# EAGLE design flashlightswitchv02 (EAGLE 9.0.0)
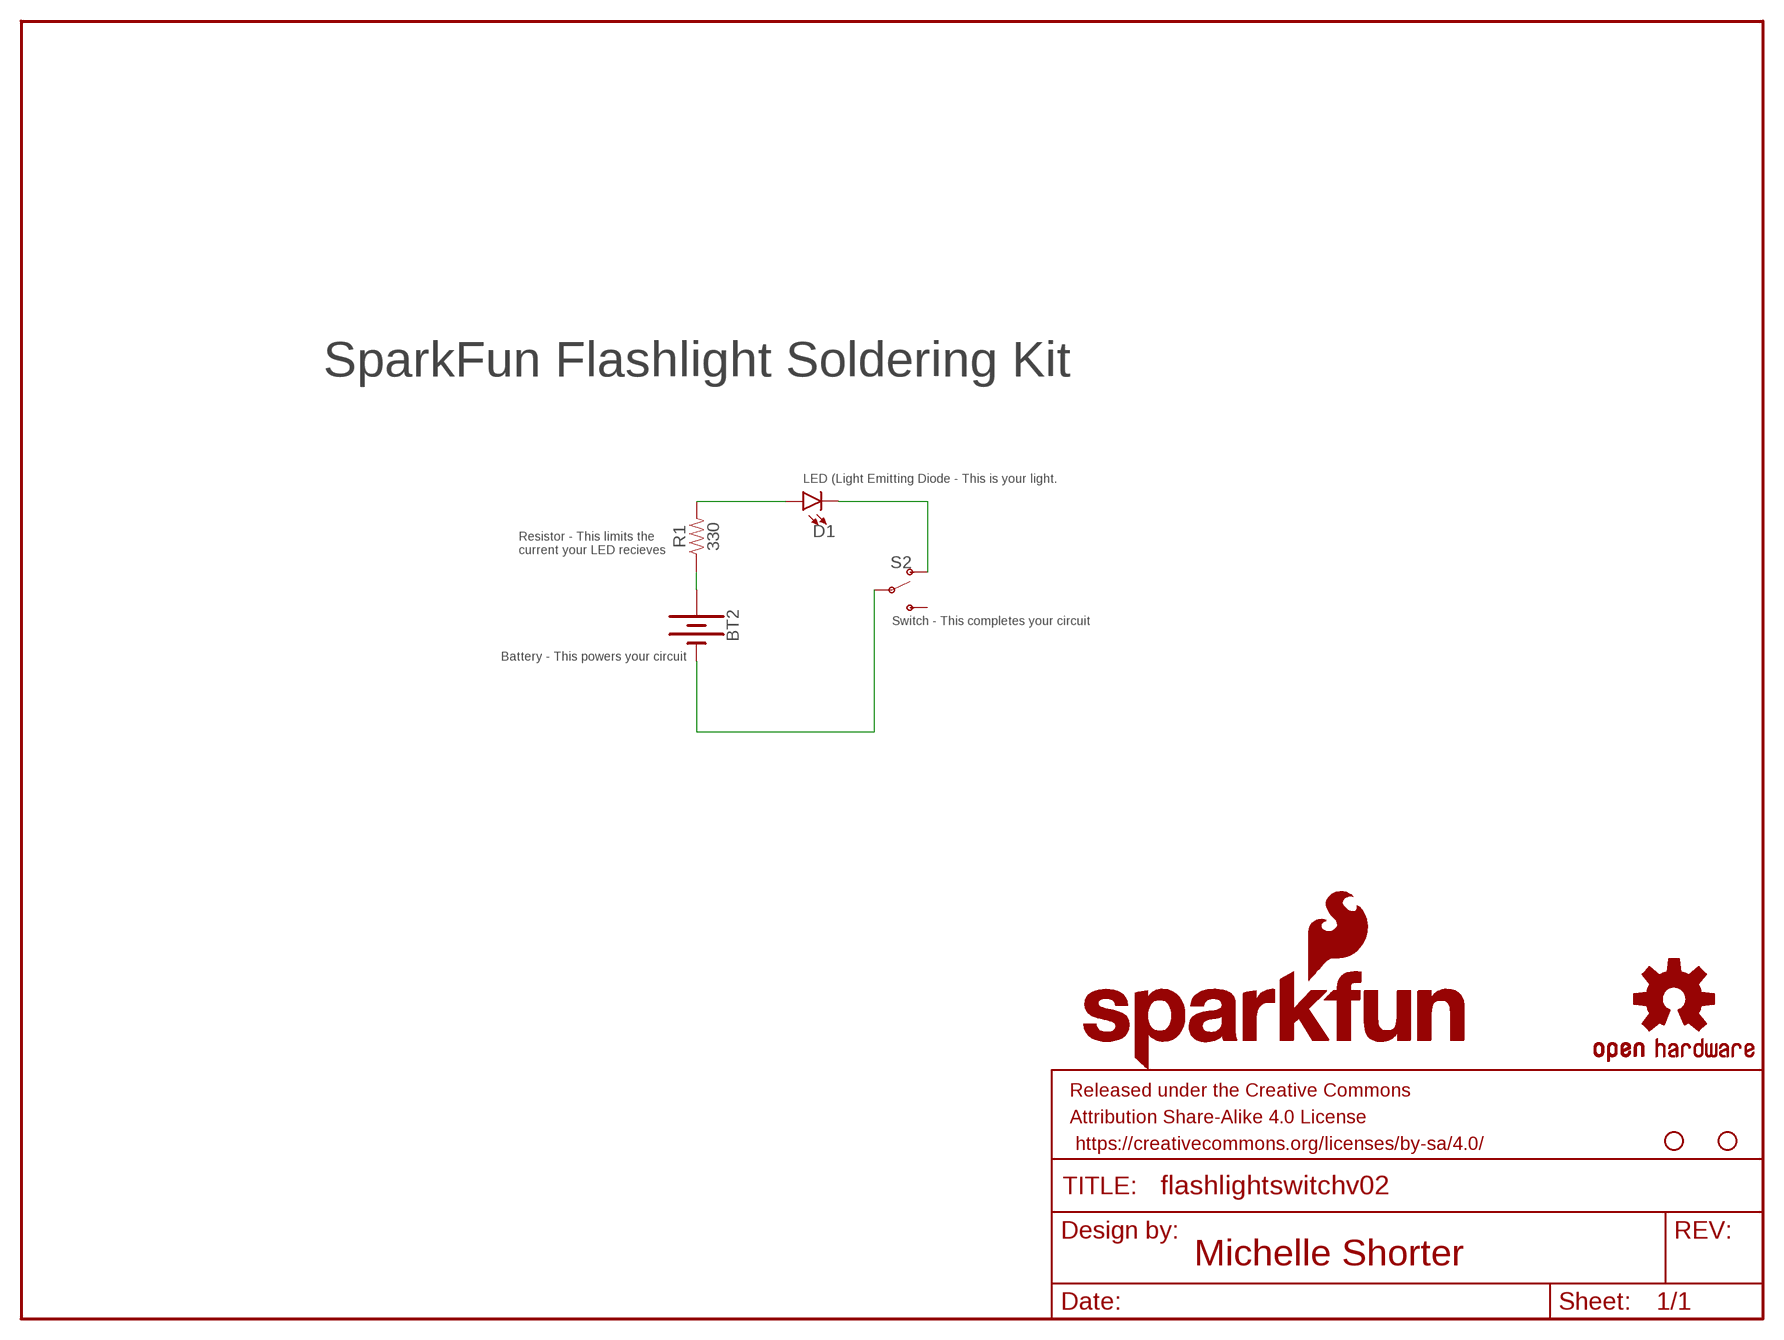
[diagram p0: schematic, sheet 1]

## Parts
BT2  BATTERY-20MM_PTH_KIT  [BATTCOM_20MM_PTH_KIT]
D1  LED-5MM-KIT-NO-SILK  [LED_5MM-KIT-NO-SILK]
FRAME1  FRAME-LETTER  [CREATIVE_COMMONS]
H1  STAND-OFF  [STAND-OFF]
H2  STAND-OFF  [STAND-OFF]
LOGO1  OSHW-LOGOS  [OSHW-LOGO-S]
LOGO2  SFE_LOGO_FLAME.1_INCH  [SFE_LOGO_FLAME_.1]
LOGO3  SFE_LOGO_NAME_FLAME.2_INCH  [SFE_LOGO_NAME_FLAME_.2]
LOGO4  SFE_LOGO_NAME.1_INCH  [SFE_LOGO_NAME_.1]
R1  330  RESISTORAXIAL-0.3-KIT  [AXIAL-0.3-KIT]
S2  SWITCH-SPDT-PTH-11.6X4.0MM-KIT  [SWITCH_SPDT_PTH_11.6X4.0MM_KIT]

## Nets
ANODE: D1.A R1.P$2
CATHODE: D1.K(C) S2.1(O)
GND: BT2.2(-) S2.2(P)
VBATT: BT2.1(+) R1.P$1
Unconnected: S2.3(S)

## Notes on the sheet
- SparkFun Flashlight Soldering Kit
- LED (Light Emitting Diode - This is your light.
- Resistor - This limits the 
  current your LED recieves
- Switch - This completes your circuit
- Battery - This powers your circuit
- Michelle Shorter

## Library data of the parts
BT2 = SparkFun-Batteries:BATTERY: Battery - Single Cell A variety of battery chemistries, sizes, and footprints. Device List: 20MM_PTH - Coin Cell Battery Holder - 20mm (PTH) <https://www.sparkfun.com/products/783> 20MM_PTH_KIT- Coin Cell battery Holder - 20 mm (PTH) <http://www.sparkfun.com/products/783>kit version with special mask 6.8MM_PTH - Coin Cell Battery Holder - 6.8MM(SMD) <https://www.digikey.com/product-detail/en/seiko-instruments/MS621FE-FL11E/728-1057-ND/1889208?WT.srch=1&gclid=CNOQ5a6LzdQCFZS2wAodXCkE0g> 12MM_SMD - Coin Cell Battery Holder - 12mm (SMD) <https://www.sparkfun.com/products/10592> 12MM_PTH - Coin Cell Battery Holder - 12mm (PTH) <https://www.sparkfun.com/products/7948> 20MM_SMD - 20mm Coin Cell Battery Holder (SMD) (2 legs) Used on the Big Time Watch Kit <https://www.sparkfun.com/products/11734> 20MM_SMD_4LEGS - Coin Cell Battery Holder - 20mm (SMD) <https://www.sparkfun.com/products/11892> 20MM_SMD_4LEGS_OVERPASTE - Coin Cell Battery Holder - 20mm (SMD) <https://www.sparkfun.com/products/11892> (Over-paste on the legs) 24.5MM_PTH - Coin Cell Battery Holder - 24.5mm (PTH) <https://www.sparkfun.com/products/8863> 9V - 9V Battery Holder - PC Mount Used on the SparkFun SparkPunk Sound Kit <https://www.sparkfun.com/products/11177> and SparkFun SparkPunk Sequencer Kit <https://www.sparkfun.com/products/12707> 18650 - Battery Holder - 18650 (PTH) <https://www.sparkfun.com/products/13113> AA - Battery Holder - 1xAA (PTH) <https://www.sparkfun.com/products/7949> AAA - Battery Holder - 1xAAA (PTH) <https://www.sparkfun.com/products/12718> AA_KIT - Battery Holder - 1xAA (PTH) <https://www.sparkfun.com/products/7949> Special kit package - pads only have exposed copper on one side of the board. AAA_KIT - Battery Holder - 1xAAA (PTH) <https://www.sparkfun.com/products/12718> Special kit package - pads only have exposed copper on one side of the board.
D1 = SparkFun-LED:LED: LED (Generic) Standard schematic elements and footprints for 5mm, 3mm, 1206, and 0603 sized LEDs. Generic LEDs with no color specified.
FRAME1 = SparkFun-Aesthetics:FRAME-LETTER: Schematic Frame - Letter Standard 8.5x11 US Letter frame
H1 H2 = SparkFun-Hardware:STAND-OFF: Stand Off Drill holes for mechanically mounting via screws, standoffs, etc. Note: Use the keepout ring to avoid running the screw head into surrounding components. Variant Overviews STAND-OFF - Mechanical footprint for a #4 phillips button head screw. STAND-OFF-TIGHT - Mechanical footprint for a #4 phillips button head screw, Example SparkFun Products Screw - Phillips Head (1/4", 4-40, 10 pack) <https://www.sparkfun.com/products/10453> (PRT-10453) Screw - Phillips Head (1/2", 4-40, 10 pack) <https://www.sparkfun.com/products/10452> (PRT-10452) Screw - Phillips Head (3/4", 4-40, 10 pack) <https://www.sparkfun.com/products/10451> (PRT-10451) Screw - Phillips Head (1", 4-40, 10 pack) <https://www.sparkfun.com/products/10450> (PRT-10450)
LOGO1 = SparkFun-Aesthetics:OSHW-LOGO: Open-Source Hardware (OSHW) Logo This logo indicates the piece of hardware it is found on incorporates a OSHW license and/or adheres to the definition of open source hardware found here: http://freedomdefined.org/OSHW
LOGO2 = SparkFun-Aesthetics:SFE_LOGO_FLAME: SparkFun Flame Logo This is the SparkFun flame logo. The logo on the schematic will always be the same size; the package variant is the height of the flame. Default layer for the logo on the board is tSilk.
LOGO3 = SparkFun-Aesthetics:SFE_LOGO_NAME_FLAME: SparkFun Font Logo w/ Flame This is the SparkFun full logo. The logo on the schematic will always be the same size; the package variant is the height of the flame part of the logo. Default layer for the logo on the board is tSilk.
LOGO4 = SparkFun-Aesthetics:SFE_LOGO_NAME: SparkFun Font Logo This is the SparkFun name logo. The logo on the schematic will always be the same size; the package variant is the height of the flame part of the logo (or the height the flame would be, if it were drawn). Default layer for the logo on the board is tSilk.
R1 = SparkFun-Resistors:RESISTOR: Generic Resistor Package
S2 = SparkFun-Switches:SWITCH-SPDT: Single Pole, Double Throw (SPDT) Switch Single-pole, double-throw (SPDT) switch. Variant Overview SMD-AYZ0202 Surface Mount DPDT Switch <https://www.sparkfun.com/products/597> (COM-00597) Used on e.g. LilyPad Arduino USB - ATmega32U4 Board <https://www.sparkfun.com/products/12049> PTH-11.6X4.0MM SPDT Mini Power Switch <https://www.sparkfun.com/products/102> (COM-00102) Used on e.g. SparkFun Simon Says - Through-Hole Soldering Kit <https://www.sparkfun.com/products/10547> (KIT-10547) PTH-11.6X4.0MM-KIT KIT version of SPDT Mini Power Switch - Simplifies soldering by removing tStop of switch pins - only one side can be soldered. PTH-11.6X4.0MM-LOCK LOCK version of SPDT Mini Power Switch - Offset pins hold switch in place for easier soldering. SMD-RIGHT-ANGLE Surface Mount Right Angle Switch <https://www.sparkfun.com/products/10860> (COM-10860) Used on e.g. SparkFun ESP8266 Thing <https://www.sparkfun.com/products/13231>; PROD_ID: SWCH-08261; SF_SKU: COM-00102

## Board
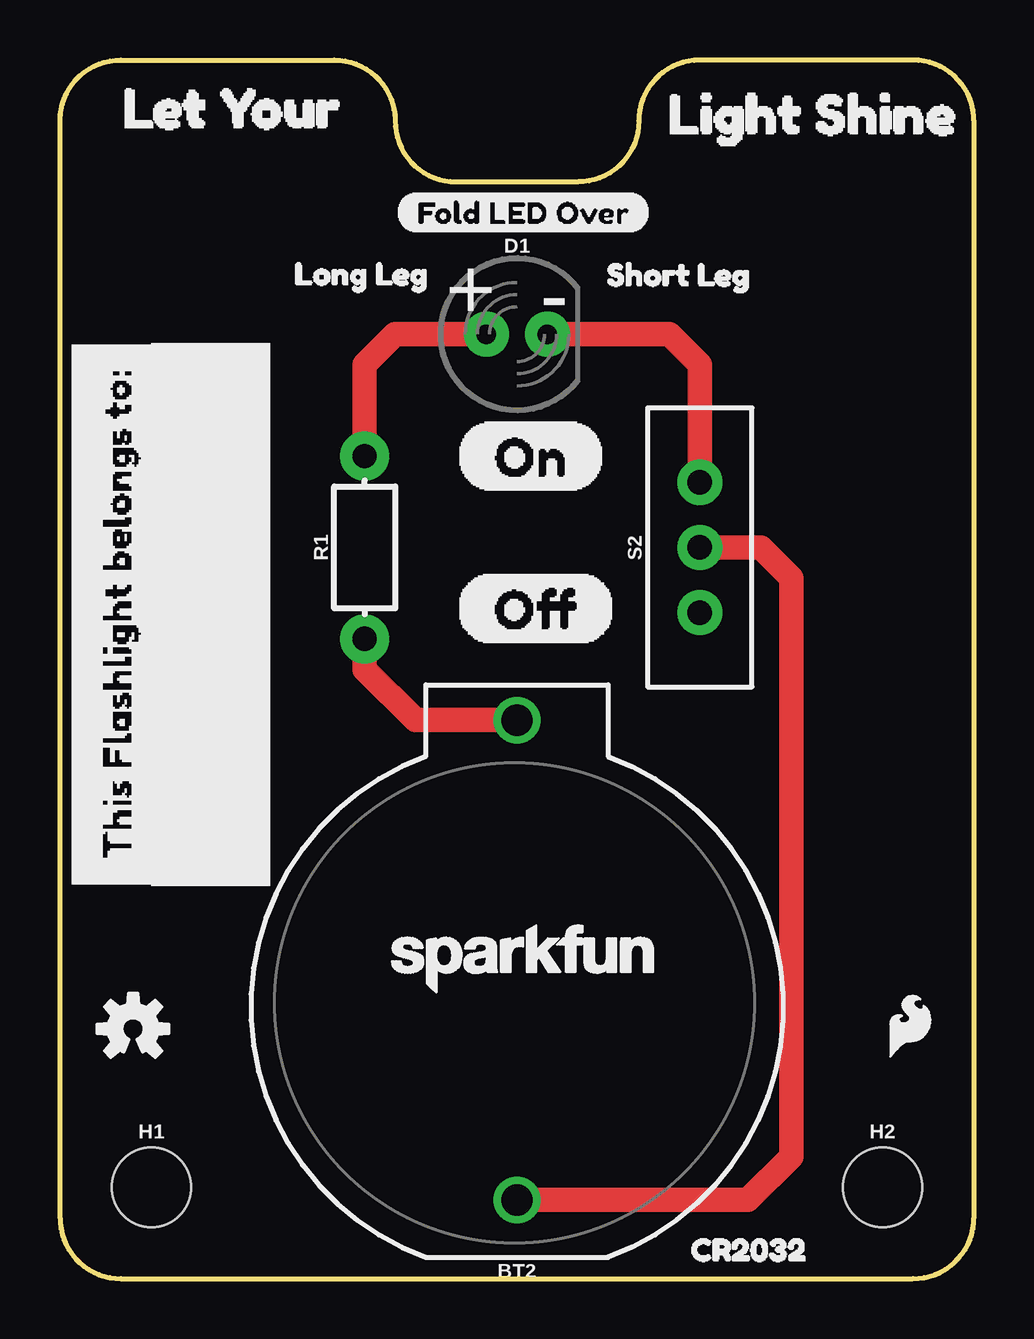
[diagram p1: board, top side]
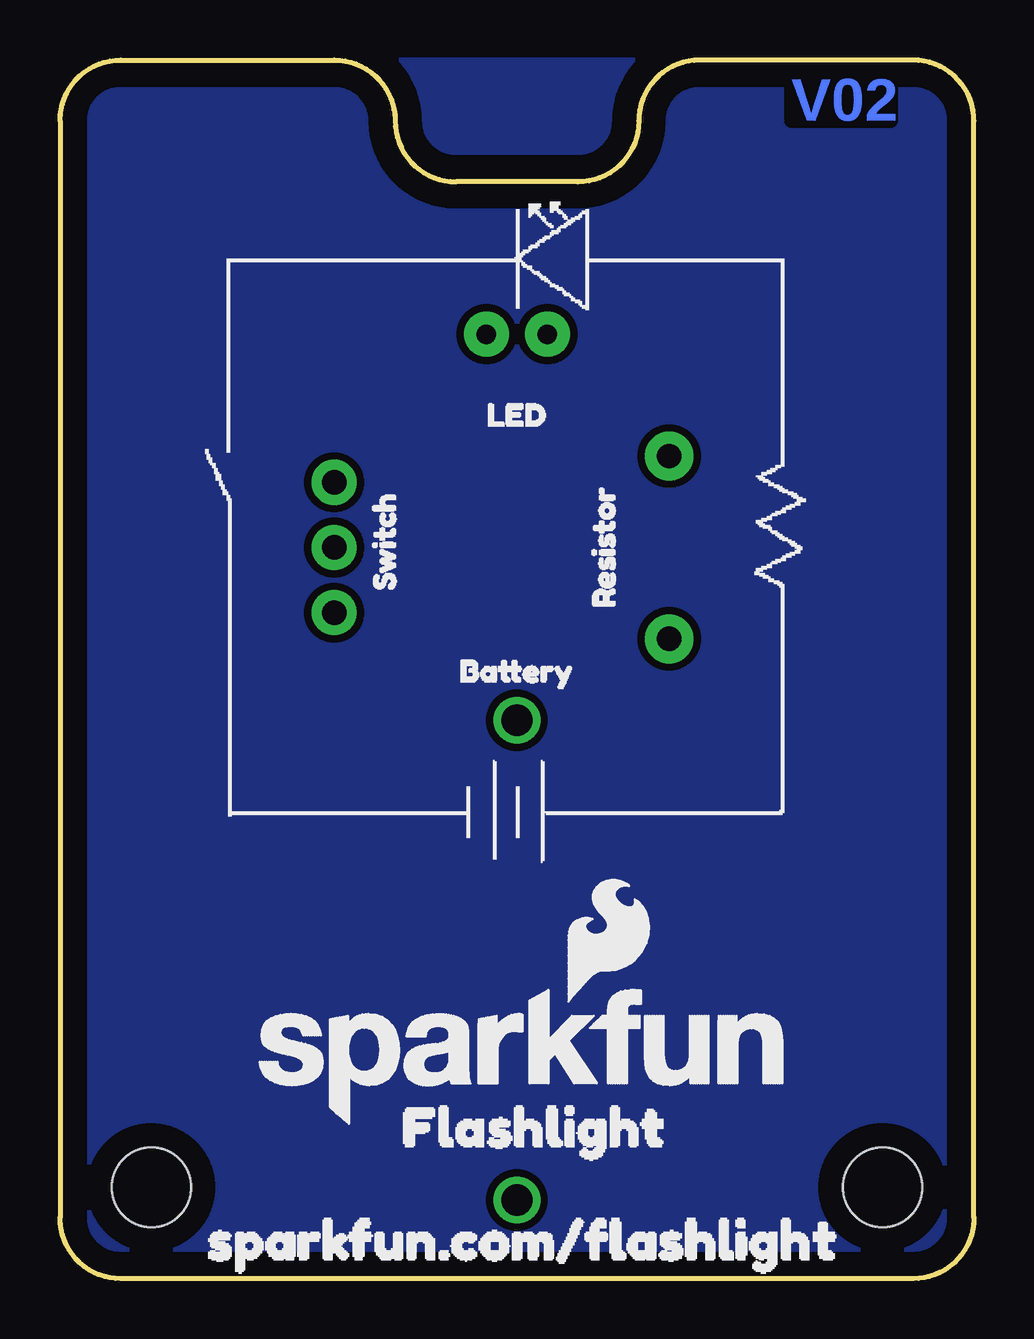
[diagram p2: board, bottom side, seen from below]

Size 38.1 x 50.8 mm. Coordinates in mm from the lower left corner, seen from the top.
Outline: 16.51,45.72 21.59,45.72 arc90 24.13,48.26 arc-90 26.67,50.8 35.56,50.8 arc-90 38.1,48.26 38.1,2.54 arc-90 35.56,0 2.54,0 arc-90 0,2.54 0,48.26 arc-90 2.54,50.8 11.43,50.8 arc-90 13.97,48.26 arc90 16.51,45.72
Copper layers (1*16): Top 0.035mm / dielectric 1.5mm / Bottom 0.035mm
Design rules "default": minimum track width 10mil, minimum drill 0.6mm, track to track 8mil, track to pad 8mil, pad to pad 8mil, via to via 8mil, smd to smd 8mil, copper to edge 40mil, drill to drill 8mil, minimum pad ring 10mil, minimum via ring 8mil, stop-mask expansion 4mil, vias tented up to drill 0mil, thermal gap 10mil

### Footprints (pad centres in the part's own frame; a part is rotated, then mirrored left to right if it is on the bottom)
BATTCOM_20MM_PTH_KIT = drill 1.3: 1 11.85,0; 2 -8.15,0
LED_5MM-KIT-NO-SILK = drill 0.813 pad 1.88: A -1.27,0; K 1.27,0
STAND-OFF = hole 3.302: 0,0
AXIAL-0.3-KIT = drill 1.016 pad 2.032: P$1 -3.81,0; P$2 3.81,0
SWITCH_SPDT_PTH_11.6X4.0MM_KIT = drill 1.016 pad 1.88: 1 0,2.718; 2 0,0; 3 0,-2.718

### Placement (x,y rotation side)
BT2  19.05,11.43 90 top
D1  19.05,39.37 0 top
FRAME1  20.32,-8.89 0 top  (outside the outline)
H1  3.81,3.81 0 top
H2  34.29,3.81 0 top
LOGO1  3.05,10.41 0 top
LOGO2  34.29,8.89 0 top
LOGO3  30.48,6.35 0 bottom
LOGO4  13.34,11.43 0 top
R1  12.7,30.48 90 top
S2  26.67,30.48 0 top
U$1  [OFF11]  16.51,27.94 0 top
U$2  [BATTERY7]  22.35,25.4 0 bottom
U$3  [CR20328]  25.4,1.27 0 top
U$4  [FOLD_LED_OVER11]  13.97,44.45 0 top
U$5  [LED5]  21.21,36.07 0 bottom
U$6  [LET_YOUR0]  1.02,48.9 0 top
U$7  [LIGHT_SHINE1]  23.75,48.64 0 top
U$8  [FLASHLIGHT12]  25.4,6.35 0 bottom
U$9  [RESISTOR4]  15.49,27.05 90 bottom
U$10  [FLASHLIGHT#JPG]  19.05,30.48 0 bottom
U$11  [THIS_FLASHLIGHT_BELONGS_TO#0]  2.54,15.24 90 top
U$12  [SWITCH6]  24.64,27.81 90 bottom
U$13  [_SHORT_LEG3]  21.59,41.91 0 top
U$14  [LONG_LEG11]  8.89,41.91 0 top
U$15  [SPARKFUN#COM#FLASHLIGHT13]  33.53,1.65 0 bottom
U$16  [ON14]  16.51,34.29 0 top

### Tracks (layer width: path | path; a pad name or v marks a point on that pad's centre or on a via)
ANODE
  Top 1.016: D1.A 13.97,39.37 12.7,38.1 R1.P$2
CATHODE
  Top 1.016: D1.K 25.4,39.37 26.67,38.1 S2.1
GND
  Top 1.016: S2.2 29.21,30.48 30.48,29.21 30.48,5.08 28.68,3.28 BT2.2
N$5
  pour Bottom (isolate 0.305): 0,50.8 0,0 38.1,0 38.1,50.8
VBATT
  Top 1.016: R1.P$1 12.7,25.4 14.82,23.28 BT2.1

### Text on the board
Bottom: V02
tPlace: + | -